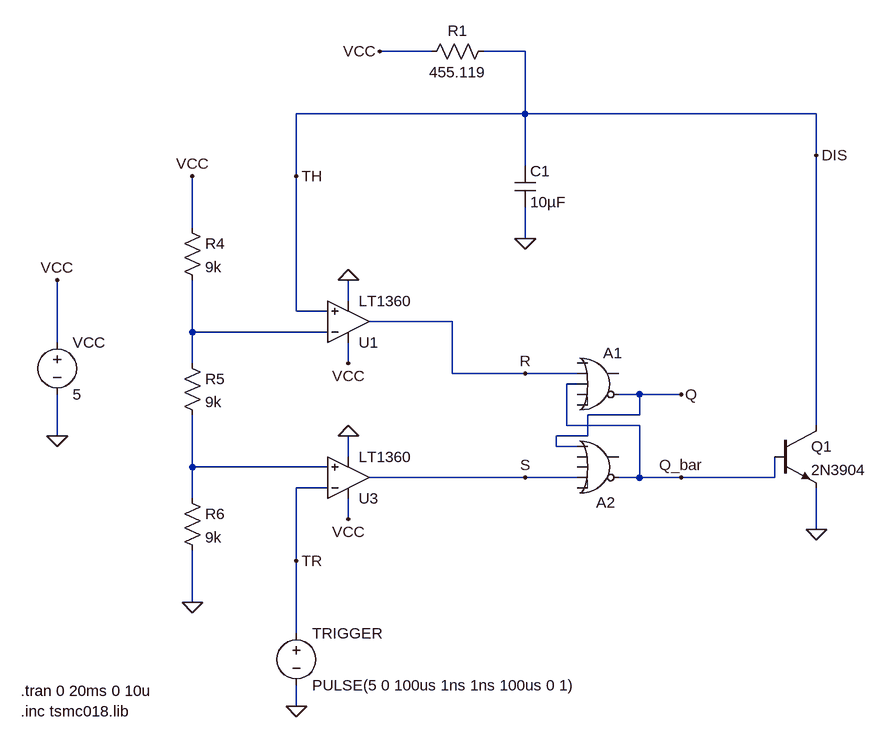
[diagram p0: schematic q1_monostable.asc]
q1_monostable.asc, the LTspice schematic file:
Version 4.1
SHEET 1 2672 1412
WIRE -368 -400 -448 -400
WIRE -224 -400 -288 -400
WIRE -224 -304 -224 -400
WIRE -224 -304 -576 -304
WIRE 224 -304 -224 -304
WIRE 224 -240 224 -304
WIRE -224 -224 -224 -304
WIRE -576 -208 -576 -304
WIRE -736 -128 -736 -208
WIRE -224 -112 -224 -160
WIRE -496 -16 -496 -48
WIRE -576 0 -576 -208
WIRE -528 0 -576 0
WIRE -336 16 -464 16
WIRE -736 32 -736 -48
WIRE -528 32 -736 32
WIRE -944 48 -944 -48
WIRE -736 80 -736 32
WIRE -496 80 -496 48
WIRE -336 96 -336 16
WIRE -224 96 -336 96
WIRE -144 96 -224 96
WIRE -144 112 -160 112
WIRE -48 128 -80 128
WIRE 16 128 -48 128
WIRE -48 160 -48 128
WIRE -48 160 -128 160
WIRE -160 176 -160 112
WIRE -48 176 -160 176
WIRE 224 176 224 -240
WIRE -944 192 -944 128
WIRE -128 192 -128 160
WIRE -128 192 -176 192
WIRE -176 208 -176 192
WIRE -144 208 -176 208
WIRE -496 224 -496 192
WIRE -736 240 -736 160
WIRE -528 240 -736 240
WIRE -224 256 -464 256
WIRE -144 256 -224 256
WIRE -48 256 -48 176
WIRE -48 256 -80 256
WIRE 16 256 -48 256
WIRE 160 256 160 224
WIRE 160 256 16 256
WIRE -528 272 -576 272
WIRE -736 288 -736 240
WIRE -496 320 -496 288
WIRE 224 336 224 272
WIRE -576 384 -576 272
WIRE -736 448 -736 368
WIRE -576 496 -576 384
WIRE -576 608 -576 576
FLAG -496 80 VCC
FLAG -496 -48 0
FLAG -496 320 VCC
FLAG -496 192 0
FLAG -736 -208 VCC
FLAG -736 448 0
FLAG -576 -208 TH
FLAG -576 384 TR
FLAG -944 192 0
FLAG -944 -48 VCC
FLAG 224 336 0
FLAG -224 256 S
FLAG -224 96 R
FLAG 16 128 Q
FLAG 16 256 Q_bar
FLAG 224 -240 DIS
FLAG -224 -112 0
FLAG -448 -400 VCC
FLAG -576 608 0
SYMBOL res -752 -144 R0
SYMATTR InstName R4
SYMATTR Value 9k
SYMBOL res -752 64 R0
SYMATTR InstName R5
SYMATTR Value 9k
SYMBOL res -752 272 R0
SYMATTR InstName R6
SYMATTR Value 9k
SYMBOL voltage -944 32 R0
WINDOW 123 0 0 Left 0
WINDOW 39 0 0 Left 0
SYMATTR InstName VCC
SYMATTR Value 5
SYMBOL Digital\\or -112 48 R0
WINDOW 3 -8 36 Invisible 2
SYMATTR Value Vhigh=5 Vlow=0 Ref=1.0
SYMATTR InstName A1
SYMBOL Digital\\or -112 176 R0
WINDOW 0 -3 118 Left 2
WINDOW 3 -3 146 Invisible 2
SYMATTR InstName A2
SYMATTR Value Vhigh=5 Vlow=0 Ref=1.0
SYMBOL cap -240 -224 R0
SYMATTR InstName C1
SYMATTR Value 10µF
SYMBOL res -272 -416 R90
WINDOW 0 0 56 VBottom 2
WINDOW 3 32 56 VTop 2
SYMATTR InstName R1
SYMATTR Value 455.119
SYMBOL voltage -576 480 R0
WINDOW 123 0 0 Left 0
WINDOW 39 0 0 Left 0
SYMATTR InstName TRIGGER
SYMATTR Value PULSE(5 0 100us 1ns 1ns 100us 0 1)
SYMBOL OpAmps\\LT1360 -496 16 M180
SYMATTR InstName U1
SYMBOL OpAmps\\LT1360 -496 256 M180
SYMATTR InstName U3
SYMBOL npn 160 176 R0
SYMATTR InstName Q1
SYMATTR Value 2N3904
TEXT -1000 616 Left 2 !.inc tsmc018.lib
TEXT -1000 584 Left 2 !.tran 0 20ms 0 10u

The netlist it stands for:
* q1_monostable.asc
R4 VCC N001 9k
R5 N001 N002 9k
R6 N002 0 9k
VCC VCC 0 5
A1 0 R Q_bar 0 0 Q 0 0 OR Vhigh=5 Vlow=0 Ref=1.0
A2 Q 0 0 S 0 Q_bar 0 0 OR Vhigh=5 Vlow=0 Ref=1.0
C1 DIS 0 10µF
R1 DIS VCC 455.119
V§TRIGGER TR 0 PULSE(5 0 100us 1ns 1ns 100us 0 1)
* U1: LT1360 (symbol OpAmps\LT1360 not available, pins judged from their places): In+=DIS In-=N001 V+=VCC V-=0 OUT=R
* U3: LT1360 (symbol OpAmps\LT1360 not available, pins judged from their places): In+=N002 In-=TR V+=VCC V-=0 OUT=S
Q1 DIS Q_bar 0 0 2N3904
.model NPN NPN
.model PNP PNP
.lib standard.bjt
.inc tsmc018.lib
.tran 0 20ms 0 10u
.backanno
.end